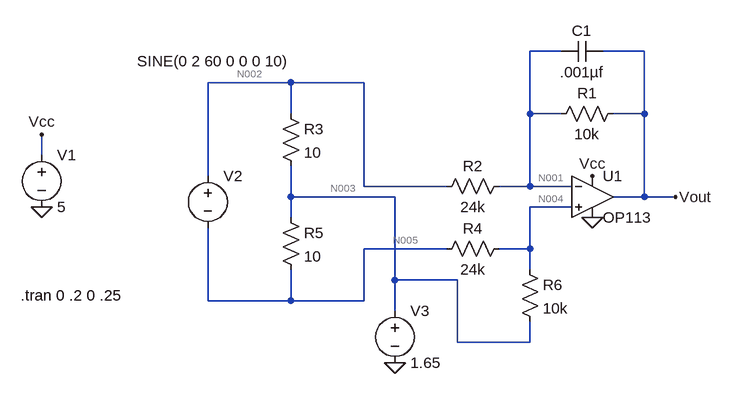
[diagram p0: schematic Voltage.asc]
Voltage.asc, the LTspice schematic file:
Version 4
SHEET 1 880 680
WIRE 416 -16 368 -16
WIRE 544 -16 480 -16
WIRE 0 32 -128 32
WIRE 112 32 0 32
WIRE 0 80 0 32
WIRE 368 80 368 -16
WIRE 416 80 368 80
WIRE 544 80 544 -16
WIRE 544 80 496 80
WIRE -384 144 -384 112
WIRE -128 176 -128 32
WIRE 112 192 112 32
WIRE 240 192 112 192
WIRE 368 192 368 80
WIRE 368 192 320 192
WIRE 432 192 368 192
WIRE 0 208 0 160
WIRE 160 208 0 208
WIRE 544 208 544 80
WIRE 544 208 496 208
WIRE 592 208 544 208
WIRE 432 224 368 224
WIRE 0 240 0 208
WIRE 240 288 112 288
WIRE 368 288 368 224
WIRE 368 288 320 288
WIRE 368 320 368 288
WIRE 160 336 160 208
WIRE 256 336 160 336
WIRE -128 368 -128 256
WIRE 0 368 0 320
WIRE 0 368 -128 368
WIRE 112 368 112 288
WIRE 112 368 0 368
WIRE 160 384 160 336
WIRE 256 432 256 336
WIRE 368 432 368 400
WIRE 368 432 256 432
FLAG 464 240 0
FLAG -384 224 0
FLAG -384 112 Vcc
FLAG 464 176 Vcc
FLAG 592 208 Vout
FLAG 160 464 0
SYMBOL Opamps\\OP113 464 144 R0
SYMATTR InstName U1
SYMBOL voltage -384 128 R0
WINDOW 123 0 0 Left 0
WINDOW 39 24 124 Left 2
SYMATTR InstName V1
SYMATTR Value 5
SYMBOL res 512 64 R90
WINDOW 0 0 56 VBottom 2
WINDOW 3 32 56 VTop 2
SYMATTR InstName R1
SYMATTR Value 10k
SYMBOL voltage -128 160 R0
WINDOW 3 -109 -161 Left 2
WINDOW 123 24 44 Left 2
WINDOW 39 0 0 Left 0
SYMATTR Value SINE(0 2 60 0 0 0 10)
SYMATTR InstName V2
SYMBOL res -16 64 R0
SYMATTR InstName R3
SYMATTR Value 10
SYMBOL cap 480 -32 R90
WINDOW 0 0 32 VBottom 2
WINDOW 3 32 32 VTop 2
SYMATTR InstName C1
SYMATTR Value .001µf
SYMBOL res 336 176 R90
WINDOW 0 0 56 VBottom 2
WINDOW 3 32 56 VTop 2
SYMATTR InstName R2
SYMATTR Value 24k
SYMBOL res -16 224 R0
SYMATTR InstName R5
SYMATTR Value 10
SYMBOL res 336 272 R90
WINDOW 0 0 56 VBottom 2
WINDOW 3 32 56 VTop 2
SYMATTR InstName R4
SYMATTR Value 24k
SYMBOL voltage 160 368 R0
WINDOW 123 0 0 Left 0
WINDOW 39 0 0 Left 0
SYMATTR InstName V3
SYMATTR Value 1.65
SYMBOL res 352 304 R0
SYMATTR InstName R6
SYMATTR Value 10k
TEXT -416 360 Left 2 !.tran 0 .2 0 .25

The netlist it stands for:
* Voltage.asc
XU1 N004 N001 Vcc 0 Vout OP113  ; pins In+ In- V+ V- OUT
V1 Vcc 0 5
R1 Vout N001 10k
V2 N002 N005 SINE(0 2 60 0 0 0 10)
R3 N002 N003 10
C1 Vout N001 .001µf
R2 N001 N002 24k
R5 N003 N005 10
R4 N004 N005 24k
V3 N003 0 1.65
R6 N004 N003 10k
.tran 0 .2 0 .25
.lib ADI.lib
.backanno
.end

* Results of the author's LTspice run, read from the files saved beside the schematic
* Operating Point, zero values left out:
*   V(vcc) = 5 V
*   V(n001) = 1.652 V
*   V(n004) = 1.652 V
*   V(vout) = 1.65 V
*   V(n002) = 1.65 V
*   V(n005) = 1.65 V
*   V(n003) = 1.65 V
*   I(R6) = 187 nA
*   I(R4) = 77.86 nA
*   I(R5) = -77.37 nA
*   I(R2) = 76.88 nA
*   I(R3) = 77.37 nA
*   I(R1) = -137.9 nA
*   I(V3) = 341.7 nA
*   I(V2) = -494.7 pA
*   I(V1) = -1.302 mA
*   Ix(u1:3) = -264.8 nA
*   Ix(u1:2) = -214.8 nA
*   Ix(u1:7) = 1.302 mA
*   Ix(u1:4) = -1.301 mA
*   Ix(u1:6) = 137.9 nA
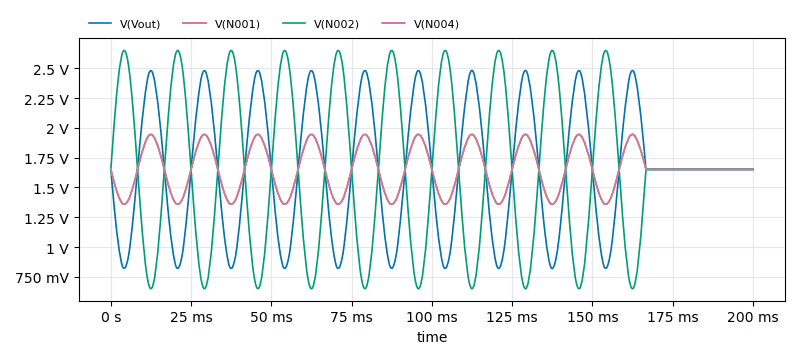
[diagram p1: Transient Analysis of Voltage.asc, plotted from the saved traces]
* Transient Analysis, 1 run:
*   V(Vout): min 819.6 mV, max 2.482 V, average 1.649 V, rms 1.733 V, last 1.65 V
*   V(N001): min 1.359 V, max 1.945 V, average 1.651 V, rms 1.662 V, last 1.652 V
*   V(N002): min 650.2 mV, max 2.65 V, average 1.651 V, rms 1.773 V, last 1.65 V
*   V(N004): min 1.359 V, max 1.945 V, average 1.651 V, rms 1.662 V, last 1.652 V